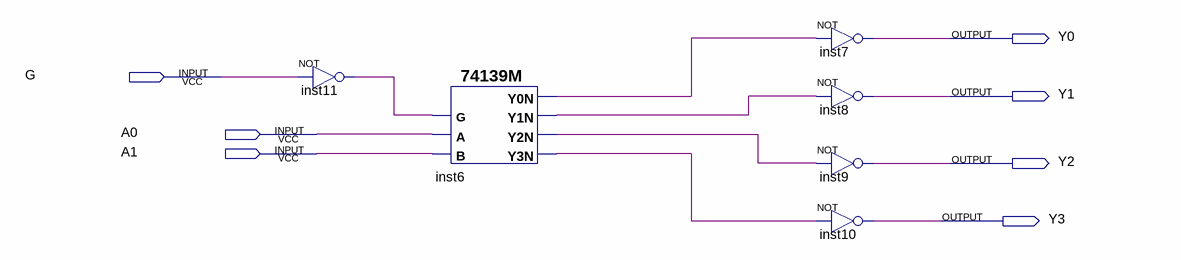
[diagram p0: schematic sheet]
// Quartus schematic 24-decoder.bdf as structural Verilog: 6 symbols, 7 pins
module \24-decoder  (
  input  G,
  input  A0,
  input  A1,
  output Y0,
  output Y1,
  output Y2,
  output Y3
);

  wire inst6_y0n, inst6_y1n, inst6_y2n, inst6_y3n, inst11_out;

  not inst11 (inst11_out, G);
  \74139M  inst6 (.B(A1), .A(A0), .G(inst11_out), .Y3N(inst6_y3n), .Y2N(inst6_y2n), .Y0N(inst6_y0n), .Y1N(inst6_y1n));
  not inst7 (Y0, inst6_y0n);
  not inst8 (Y1, inst6_y1n);
  not inst9 (Y2, inst6_y2n);
  not inst10 (Y3, inst6_y3n);
endmodule
